# Altium schematic sheet Sheet1.SchDoc
size A4; SheetNumber: 1; SheetTotal: 1
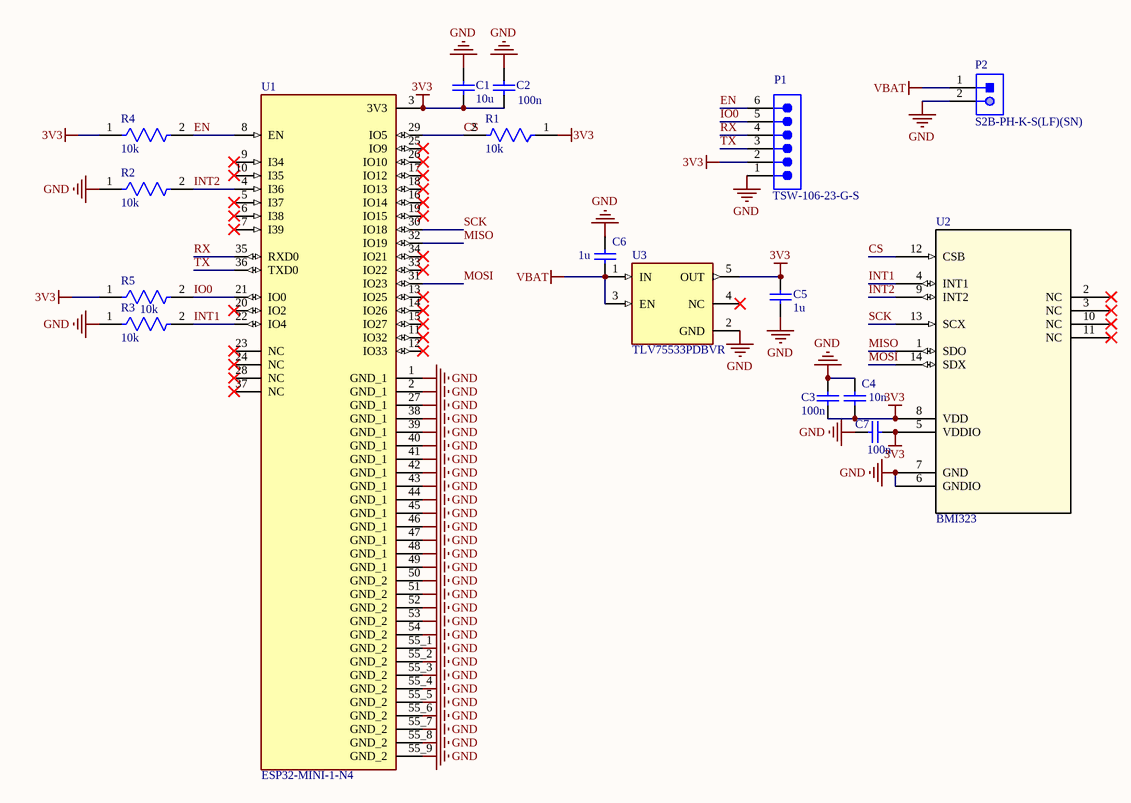
[diagram p0: Sheet1.SchDoc]

## Parts
C1  10u  [CAPC2013X145X48NL20T23]
C2  100n  [CAPC2013X145X48NL20T23]
C3  100n  [CAPC2013X145X48NL20T23]
C4  10n  [CAPC2013X145X48NL20T23]
C5  1u  [CAPC2013X145X48NL20T23]
C6  1u  [CAPC2013X145X48NL20T23]
C7  100n  [CAPC2013X145X48NL20T23]
P1  TSW-106-23-G-S  [SMTC-TSW-106-23-X-S]
P2  S2B-PH-K-S(LF)(SN)  [JST-S2B-PH-K-S_V]
R1  10k  [FP-MCU0805-IPC_B]
R2  10k  [FP-MCU0805-IPC_B]
R3  10k  [FP-MCU0805-IPC_B]
R4  10k  [FP-MCU0805-IPC_B]
R5  10k  [FP-MCU0805-IPC_B]
U1  ESP32-MINI-1-N4  [XCVR_ESP32-MINI-1-N4]
U2  BMI323  [BMI323_BOS]
U3  TLV75533PDBVR  [FP-DBV0005A-MFG]

## Nets
3V3: C1.1 C2.1 C3.1 C4.1 C5.1 C7.1 P1.2 R1.1 R4.1 R5.1 U1.3(3V3) U2.5(VDDIO) U2.8(VDD) U3.5(OUT)
GND: C1.2 C2.2 C3.2 C4.2 C5.2 C6.2 C7.2 P1.1 P2.2 R2.1 R3.1 U1.1(GND_1) U1.2(GND_1) U1.27(GND_1) U1.38(GND_1) U1.39(GND_1) U1.40(GND_1) U1.41(GND_1) U1.42(GND_1) U1.43(GND_1) U1.44(GND_1) U1.45(GND_1) U1.46(GND_1) U1.47(GND_1) U1.48(GND_1) U1.49(GND_1) U1.50(GND_2) U1.51(GND_2) U1.52(GND_2) U1.53(GND_2) U1.54(GND_2) U1.55_1(GND_2) U1.55_2(GND_2) U1.55_3(GND_2) U1.55_4(GND_2) U1.55_5(GND_2) U1.55_6(GND_2) U1.55_7(GND_2) U1.55_8(GND_2) U1.55_9(GND_2) U2.6(GNDIO) U2.7(GND) U3.2(GND)
VBAT: C6.1 P2.1 U3.1(IN) U3.3(EN)
CS: R1.2 U1.29(IO5) U2.12(CSB)
EN: P1.6 R4.2 U1.8(EN)
INT1: R3.2 U1.22(IO4) U2.4(INT1)
INT2: R2.2 U1.4(I36) U2.9(INT2)
IO0: P1.5 R5.2 U1.21(IO0)
MISO: U1.32(IO19) U2.1(SDO)
MOSI: U1.31(IO23) U2.14(SDX)
RX: P1.4 U1.35(RXD0)
SCK: U1.30(IO18) U2.13(SCX)
TX: P1.3 U1.36(TXD0)

Not connected (* = marked no-connect by the designer): U1 5(I37)* 6(I38)* 7(I39)* 9(I34)* 10(I35)* 11(IO32)* 12(IO33)* 13(IO25)* 14(IO26)* 15(IO27)* 16(IO14)* 17(IO12)* 18(IO13)* 19(IO15)* 20(IO2)* 23(NC)* 24(NC)* 25(IO9)* 26(IO10)* 28(NC)* 33(IO22)* 34(IO21)* 37(NC)*; U2 2(NC)* 3(NC)* 10(NC)* 11(NC)*; U3 4(NC)*

## Library data of the parts
C1-C7 = CMP-2007-01790-1: Manufacturer: Vitramon; Part Number: VJ0805Y222JXAAC
P1 = CMP-1024-00396-1: 0.025" SQ Post Header, Through-hole, Vertical, -55 to 125 degC, 2.54 mm Pitch, 6-Pin, Male, RoHS; Manufacturer: Samtec; Pitch: 2.54 mm; Orientation: Vertical; Mounting Technology: Through-hole; RoHS: True; PackageVersion: DM, 8/1988; ComponentLink3Description: Package Specification; PackageDescription: .025[0.64] SQ. Post Terminal Strip Assembly; ComponentLink2URL: http://www.samtec.com/documents/webfiles/pdf/TSW_TH.PDF; PartNumber: TSW-106-23-G-S; Temperature Range: -55 to 125 degC; PackageReference: TSW-106-23-X-S; ComponentLink1Description: Manufacturer URL; ComponentLink2Description: Datasheet; ComponentLink3URL: http://www.samtec.com/documents/webfiles/cpdf/TSW-XXX-XX-XXX-X-XX-XXX-MKT.pdf; DatasheetVersion: F-214; ComponentLink1URL: http://www.samtec.com
P2 = CMP-1755-00004-1: Male Header, Pitch 2 mm, 1 x 2 Position, Height 4.8 mm, Tail Length 3.4 mm, -25 to 85 degC, RoHS, Bulk; Case\Package: Radial; Tolerance: 20%; Capacitance: 10 uF; Voltage Rating (DC): 50 V; Packaging: Bulk; ComponentLink1URL: http://www.jst-mfg.com/product/pdf/eng/ePH.pdf; Radiation Hardening: No; Height: 11 mm; Package Quantity: 200; PackageDescription: Male Header, Pitch 2 mm, 1 x 2 Position, Height 4.8 mm, Tail Length 3.4 mm; PackageReference: S2B-PH-K-S; Diameter: 5 mm; Pins: 2; Mount: Through Hole; Max Operating Temperature: 85 degC; Min Operating Temperature: -40 degC; ComponentLink1Description: Datasheet; DatasheetVersion: Dec-12; Length: 11 mm; Lead Pitch: 2 mm; REACH SVHC: No SVHC; Voltage Rating: 50 V; RoHSCompliant: true
R1 = CMP-02407-001108-1: Voltage Rating: 150V; Temperature Coefficient: 25ppm/°C; Tolerance: 0.1%; Max Power Dissipation: 200mW; Resistance: 51.1kR; Case Code (Metric): 2012; Composition: Thin Film; Number of Terminations: 2; Termination: SMD/SMT; Min Operating Temperature: -55°C; Package Quantity: 1000; Packaging: Tape and Reel; Case Code (Imperial): 0805; Max Operating Temperature: 155°C; Length: 0.079inch; Width: 0.049inch; Weight: 0.000162oz; Height: 0.024inch; Features: Automotive AEC-Q200; Case/Package: 0805; Power Rating: 200mW
R2-R5 = CMP-02407-001108-1: RES 1.05K OHM 0.5% 1/5W 0805; Voltage Rating: 150V; Temperature Coefficient: 25ppm/°C; Tolerance: 0.1%; Max Power Dissipation: 200mW; Resistance: 51.1kR; Case Code (Metric): 2012; Composition: Thin Film; Number of Terminations: 2; Termination: SMD/SMT; Min Operating Temperature: -55°C; Package Quantity: 1000; Packaging: Tape and Reel; Case Code (Imperial): 0805; Max Operating Temperature: 155°C; Length: 0.079inch; Width: 0.049inch; Weight: 0.000162oz; Height: 0.024inch; Features: Automotive AEC-Q200; Case/Package: 0805; Power Rating: 200mW
U1 = ESP32-MINI-1-N4: Bluetooth, WiFi 802.11b/g/n, Bluetooth v4.2 +EDR, Class 1, 2 and 3 Transceiver Module 2.412GHz ~ 2.484GHz Integrated, Trace Chassis Mount; MF: Espressif Systems; SnapEDA_Link: https://www.snapeda.com/parts/ESP32-MINI-1-N4/Espressif+Systems/view-part/?ref=snap; Package: Module Espressif Systems; Value: *; MP: ESP32-MINI-1-N4; Check_prices: https://www.snapeda.com/parts/ESP32-MINI-1-N4/Espressif+Systems/view-part/?ref=eda
U2 = BMI323: Description; Manufacturer_Name: Bosch Sensortec; Copyright: Copyright (C) 2026 Ultra Librarian. All rights reserved.; Manufacturer_Part_Number: BMI323; RefDes: RefDes; Type: Type
U3 = CMP-04917-000010-1: IC REG LINEAR 3.3V 500MA SOT23-5; Manufacturer: Texas Instruments; Dropout Voltage: 150mV; Max Junction Temp: +125°C; Number Of Outputs: 1; Output Type: Fixed; Accuracy Percentage: 1%; Standoff Height: 0mm; Max Supply Voltage: 5.5V; Min Supply Voltage: 1.45V; RoHS: TRUE; ComponentLink2Description: Datasheet; Octopart: https://octopart.com/tlv75533pdbvr-texas+instruments-91272349; Ambient Temperature Range High: +70°C; Device Class L2: Power Management ICs; Lead Free: Yes; Temperature Range Low: -40°C; Output Current: 500mA; Temperature: -40°C to +125°C; Automotive: No; Manufacturer Part Number: TLV75533PDBVR; Digikey Description: IC REG LINEAR 3.3V 500MA SOT23-5; Height: 1.45mm; Temperature Range High: +125°C; ComponentLink2URL: http://www.ti.com/lit/ds/symlink/tlv755p.pdf; Device Class L3: Voltage Regulators - Linear; Device Class L1: Integrated Circuits (ICs); Output Voltage: 3.3V; Mouser Description: 500-mA low-IQ small-size low-dropout (LDO) regulator 5-SOT-23 -40 to 125; Package: DBV0005A; Category: IC